# Altium schematic sheet ET-IO.SchDoc
size A4
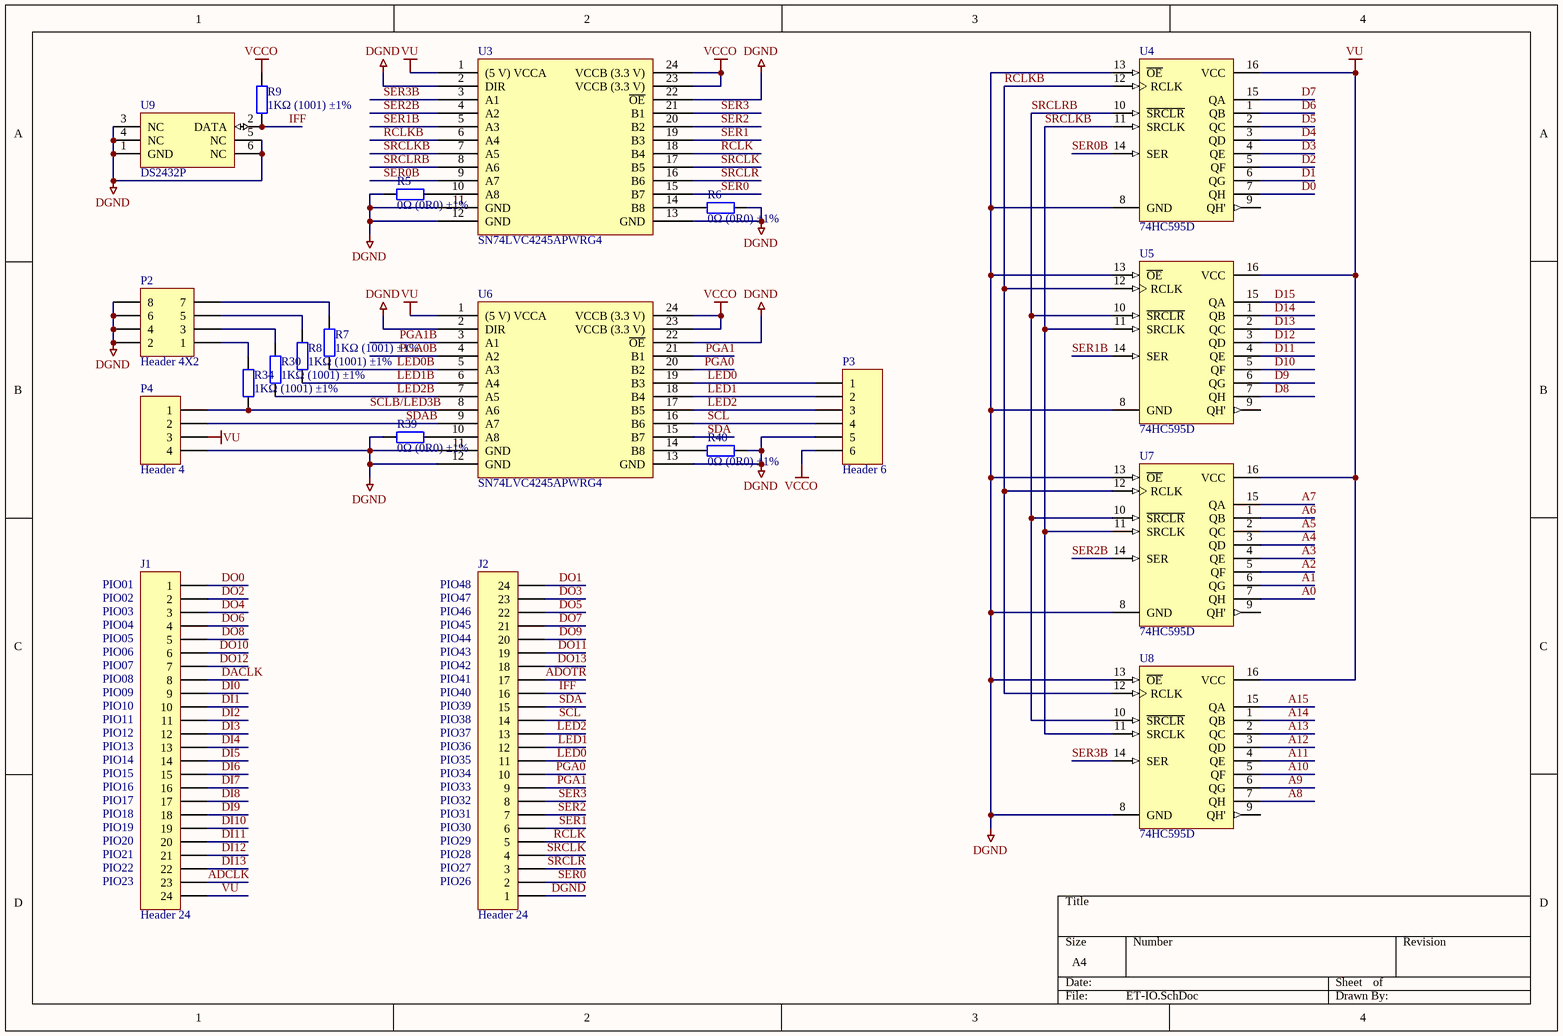
[diagram p0: ET-IO.SchDoc]

## Parts
J1  Header 24  [HDR1X24]
J2  Header 24  [HDR1X24]
P2  Header 4X2  [HDR2X4]
P3  Header 6  [HDR1X6]
P4  Header 4  [HDR1X4]
R5  0Ω (0R0) ±1%  [LC-0805_R]
R6  0Ω (0R0) ±1%  [LC-0805_R]
R7  1KΩ (1001) ±1%  [LC-0805_R]
R8  1KΩ (1001) ±1%  [LC-0805_R]
R9  1KΩ (1001) ±1%  [LC-0805_R]
R30  1KΩ (1001) ±1%  [LC-0805_R]
R34  1KΩ (1001) ±1%  [LC-0805_R]
R39  0Ω (0R0) ±1%  [LC-0805_R]
R40  0Ω (0R0) ±1%  [LC-0805_R]
U3  SN74LVC4245APWRG4  [LC-TSSOP-24]
U4  74HC595D  [LC-SOIC-16_150mil]
U5  74HC595D  [LC-SOIC-16_150mil]
U6  SN74LVC4245APWRG4  [LC-TSSOP-24]
U7  74HC595D  [LC-SOIC-16_150mil]
U8  74HC595D  [LC-SOIC-16_150mil]
U9  DS2432P  [TSOC6]

## Nets
DGND: J2.1 P2.2 P2.4 P2.6 P2.8 P3.5 P4.4 R5.1 R6.2 R39.1 R40.2 U3.2(DIR) U3.11(GND) U3.12(GND) U3.13(GND) U3.22(~{OE}) U4.8(GND) U4.13(~{OE}) U5.8(GND) U5.13(~{OE}) U6.2(DIR) U6.11(GND) U6.12(GND) U6.13(GND) U6.22(~{OE}) U7.8(GND) U7.13(~{OE}) U8.8(GND) U8.13(~{OE}) U9.1(GND) U9.3(NC) U9.4(NC) U9.5(NC) U9.6(NC)
VCCO: P3.6 R9.1 U3.23(VCCB_(3.3_V)) U3.24(VCCB_(3.3_V)) U6.23(VCCB_(3.3_V)) U6.24(VCCB_(3.3_V))
VU: J1.24 P4.3 U3.1((5_V)_VCCA) U4.16(VCC) U5.16(VCC) U6.1((5_V)_VCCA) U7.16(VCC) U8.16(VCC)
A0: U7.7(QH)
A1: U7.6(QG)
A2: U7.5(QF)
A3: U7.4(QE)
A4: U7.3(QD)
A5: U7.2(QC)
A6: U7.1(QB)
A7: U7.15(QA)
A8: U8.7(QH)
A9: U8.6(QG)
A10: U8.5(QF)
A11: U8.4(QE)
A12: U8.3(QD)
A13: U8.2(QC)
A14: U8.1(QB)
A15: U8.15(QA)
ADCLK: J1.23
ADOTR: J2.17
D0: U4.7(QH)
D1: U4.6(QG)
D2: U4.5(QF)
D3: U4.4(QE)
D4: U4.3(QD)
D5: U4.2(QC)
D6: U4.1(QB)
D7: U4.15(QA)
D8: U5.7(QH)
D9: U5.6(QG)
D10: U5.5(QF)
D11: U5.4(QE)
D12: U5.3(QD)
D13: U5.2(QC)
D14: U5.1(QB)
D15: U5.15(QA)
DACLK: J1.8
DI0: J1.9
DI1: J1.10
DI2: J1.11
DI3: J1.12
DI4: J1.13
DI5: J1.14
DI6: J1.15
DI7: J1.16
DI8: J1.17
DI9: J1.18
DI10: J1.19
DI11: J1.20
DI12: J1.21
DI13: J1.22
DO0: J1.1
DO1: J2.24
DO2: J1.2
DO3: J2.23
DO4: J1.3
DO5: J2.22
DO6: J1.4
DO7: J2.21
DO8: J1.5
DO9: J2.20
DO10: J1.6
DO11: J2.19
DO12: J1.7
DO13: J2.18
IFF: J2.16 R9.2 U9.2(DATA)
LED0: J2.11 P3.1 U6.19(B3)
LED0B: R7.2 U6.5(A3)
LED1: J2.12 P3.2 U6.18(B4)
LED1B: R8.2 U6.6(A4)
LED2: J2.13 P3.3 U6.17(B5)
LED2B: R30.1 U6.7(A5)
PGA0: J2.10 U6.20(B2)
PGA0B: U6.4(A2)
PGA1: J2.9 U6.21(B1)
PGA1B: U6.3(A1)
RCLK: J2.5 U3.18(B4)
RCLKB: U3.6(A4) U4.12(RCLK) U5.12(RCLK) U7.12(RCLK) U8.12(RCLK)
SCL: J2.14 P3.4 U6.16(B6)
SCLB/LED3B: P4.1 R34.2 U6.8(A6)
SDA: J2.15 U6.15(B7)
SDAB: P4.2 U6.9(A7)
SER0: J2.2 U3.15(B7)
SER0B: U3.9(A7) U4.14(SER)
SER1: J2.6 U3.19(B3)
SER1B: U3.5(A3) U5.14(SER)
SER2: J2.7 U3.20(B2)
SER2B: U3.4(A2) U7.14(SER)
SER3: J2.8 U3.21(B1)
SER3B: U3.3(A1) U8.14(SER)
SRCLK: J2.4 U3.17(B5)
SRCLKB: U3.7(A5) U4.11(SRCLK) U5.11(SRCLK) U7.11(SRCLK) U8.11(SRCLK)
SRCLR: J2.3 U3.16(B6)
SRCLRB: U3.8(A6) U4.10(~{SRCLR}) U5.10(~{SRCLR}) U7.10(~{SRCLR}) U8.10(~{SRCLR})
NetP2_1: P2.1 R34.1
NetP2_3: P2.3 R30.2
NetP2_5: P2.5 R8.1
NetP2_7: P2.7 R7.1
NetR5_2: R5.2 U3.10(A8)
NetR6_1: R6.1 U3.14(B8)
NetR39_2: R39.2 U6.10(A8)
NetR40_1: R40.1 U6.14(B8)

Not connected (* = marked no-connect by the designer): U4 9(QH'); U5 9(QH'); U7 9(QH'); U8 9(QH')

## Notes on the sheet
- (near J1) PIO01
- (near J1) PIO02
- (near J1) PIO03
- (near J1) PIO04
- (near J1) PIO05
- (near J1) PIO06
- (near J2) PIO48
- (near J2) PIO47
- (near J2) PIO46
- (near J2) PIO45
- (near J2) PIO44
- (near J2) PIO43
- (near J1) PIO07
- (near J1) PIO08
- (near J1) PIO09
- (near J1) PIO10
- (near J2) PIO42
- (near J2) PIO41
- (near J2) PIO40
- (near J2) PIO39
- (near J1) PIO11
- (near J1) PIO12
- (near J1) PIO13
- (near J1) PIO14
- (near J1) PIO15
- (near J1) PIO16
- (near J2) PIO38
- (near J2) PIO37
- (near J2) PIO36
- (near J2) PIO35
- (near J2) PIO34
- (near J2) PIO33
- (near J1) PIO17
- (near J1) PIO18
- (near J1) PIO19
- (near J1) PIO20
- (near J2) PIO32
- (near J2) PIO31
- (near J2) PIO30
- (near J2) PIO29
- (near J1) PIO21
- (near J1) PIO22
- (near J1) PIO23
- (near J2) PIO28
- (near J2) PIO27
- (near J2) PIO26

## Library data of the parts
J1 J2 = Header 24: Header, 24-Pin; LatestRevisionDate: 17-Jul-2002; LatestRevisionNote: Re-released for DXP Platform.; Publisher: Altium Limited
P2 = Header 4X2: Header, 4-Pin, Dual row; LatestRevisionDate: 17-Jul-2002; LatestRevisionNote: Re-released for DXP Platform.; Publisher: Altium Limited
P3 = Header 6: Header, 6-Pin; LatestRevisionDate: 17-Jul-2002; LatestRevisionNote: Re-released for DXP Platform.; Publisher: Altium Limited
P4 = Header 4: Header, 4-Pin; LatestRevisionDate: 17-Jul-2002; LatestRevisionNote: Re-released for DXP Platform.; Publisher: Altium Limited
R5 R6 R39 R40 = 0805 0Ω (0R0) 1%: 贴片电阻; ComponentLink1Description: 供应商链接; ComponentLink1URL: http://www.szlcsc.com/product/details_18165.html; Package: 0805; Supplier: LC; SuppliersPartNumber: C17477
R7-R9 R30 R34 = 0805 1KΩ (1001) 1%: 贴片电阻; ComponentLink1Description: 供应商链接; ComponentLink1URL: http://www.szlcsc.com/product/details_18201.html; Package: 0805; Supplier: LC; SuppliersPartNumber: C17513
U3 U6 = SN74LVC4245APWRG4: 74系列逻辑芯片; ComponentLink1Description: 供应商链接; ComponentLink1URL: http://www.szlcsc.com/product/details_8336.html; Package: TSSOP-24; Supplier: LC; SuppliersPartNumber: C7859
U4 U5 U7 U8 = 74HC595D: 74系列逻辑芯片; ComponentLink1Description: 供应商链接; ComponentLink1URL: http://www.szlcsc.com/product/details_6413.html; Package: SOIC-16_150mil; Supplier: LC; SuppliersPartNumber: C5947
U9 = DS2430AP: 256-Bit 1-Wire EEPROM; Note: Pin numbers 3-6 are Not Connected (NC); Published: 13-Oct-2000; LatestRevisionDate: 17-Jul-2002; LatestRevisionNote: Re-released for DXP Platform.; DatasheetVersion: 21-Oct-1999; PackageVersion: 1999; PackageReference: TSOC6; Publisher: Altium Limited; PackageDescription: Small Outline; 6 C-Bend Leads; Body Width 3.8 mm; Pitch 1.27 mm; ComponentLink1Description: Manufacturer Link; ComponentLink1URL: http://www.maxim-ic.com/; ComponentLink2Description: Datasheet; ComponentLink2URL: http://pdfserv.maxim-ic.com/en/ds/DS2430A.pdf